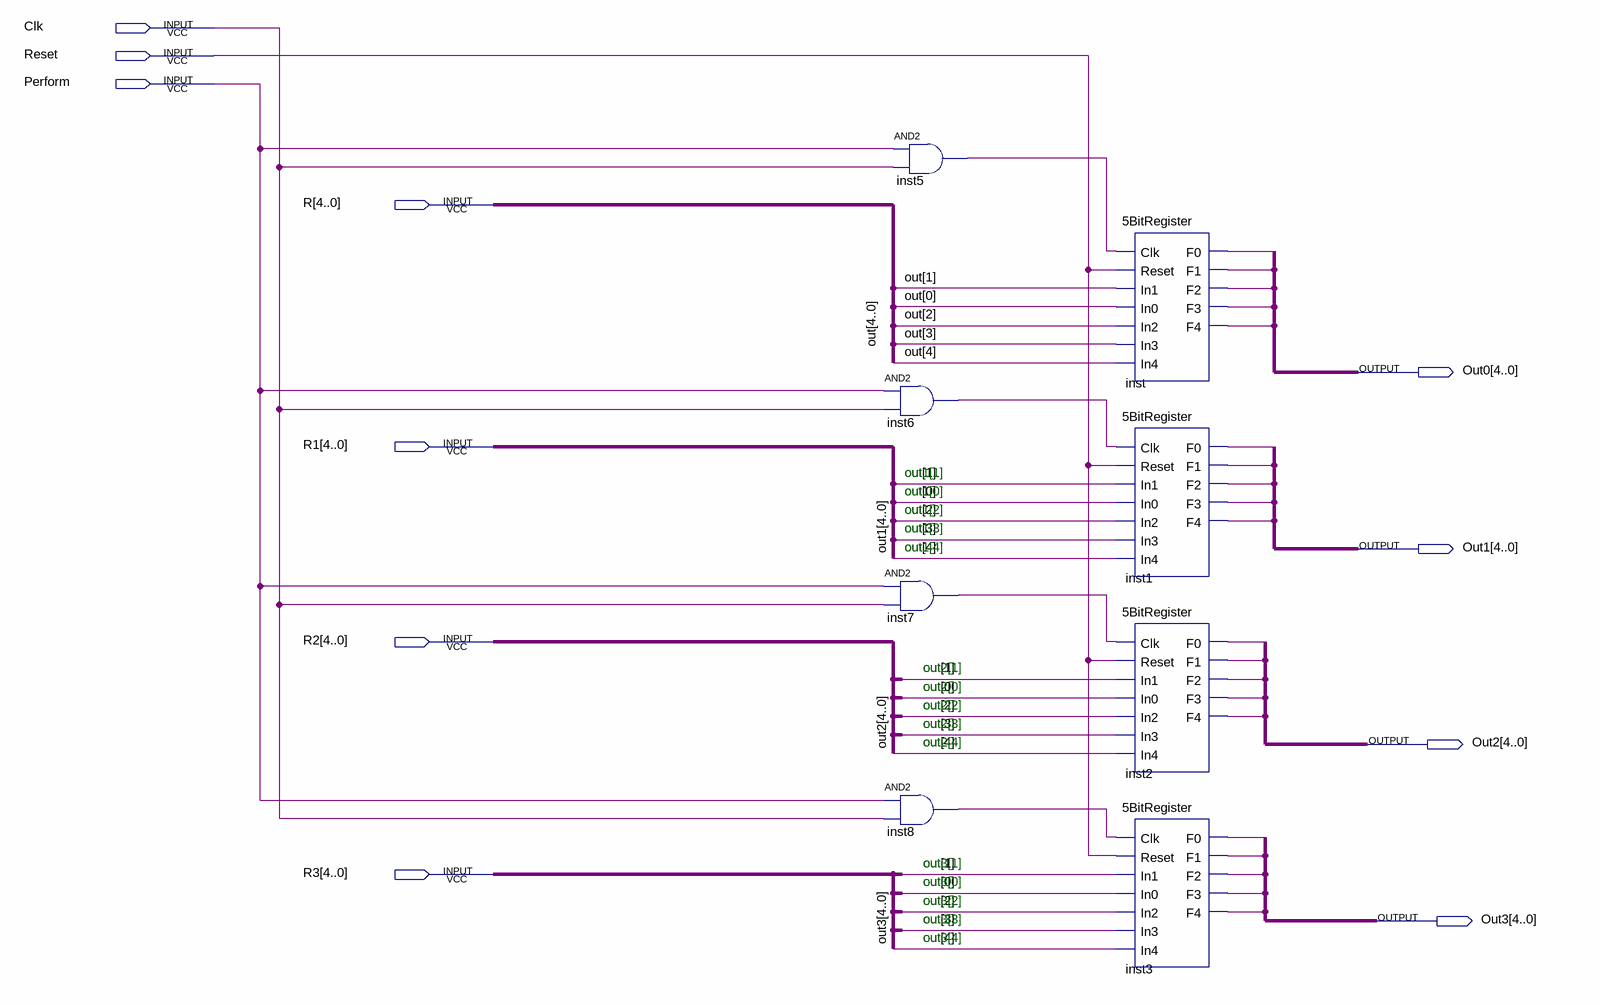
[diagram p0: schematic sheet]
// Quartus schematic FSM.bdf as structural Verilog: 8 symbols, 11 pins
module FSM (
  input  Clk,
  input  Reset,
  input  Perform,
  input  [4:0] R,
  input  [4:0] R1,
  input  [4:0] R2,
  input  [4:0] R3,
  output [4:0] Out0,
  output [4:0] Out1,
  output [4:0] Out2,
  output [4:0] Out3
);

  wire inst1_f0, inst1_f1, inst1_f2, inst1_f3, inst1_f4, inst2_f0, inst2_f1, inst2_f2, inst2_f3, inst2_f4,
       inst3_f0, inst3_f1, inst3_f2, inst3_f3, inst3_f4, inst5_out, inst6_out, inst7_out, inst8_out, inst_f0,
       inst_f1, inst_f2, inst_f3, inst_f4;

  and inst6 (inst6_out, Perform, Clk);
  and inst7 (inst7_out, Perform, Clk);
  and inst8 (inst8_out, Perform, Clk);
  and inst5 (inst5_out, Perform, Clk);
  \5BitRegister  inst (
    .Clk(inst5_out), .Reset(Reset), .In1(R[1]), .In0(R[0]), .In2(R[2]), .In3(R[3]), .In4(R[4]), .F0(inst_f0),
    .F1(inst_f1), .F2(inst_f2), .F3(inst_f3), .F4(inst_f4));
  \5BitRegister  inst1 (
    .Clk(inst6_out), .Reset(Reset), .In1(R[1]), .In0(R[0]), .In2(R[2]), .In3(R[3]), .In4(R[4]),
    .F0(inst1_f0), .F1(inst1_f1), .F2(inst1_f2), .F3(inst1_f3), .F4(inst1_f4));
  \5BitRegister  inst2 (
    .Clk(inst7_out), .Reset(Reset), .In1(R[1]), .In0(R[0]), .In2(R[2]), .In3(R[3]), .In4(R[4]),
    .F0(inst2_f0), .F1(inst2_f1), .F2(inst2_f2), .F3(inst2_f3), .F4(inst2_f4));
  \5BitRegister  inst3 (
    .Clk(inst8_out), .Reset(Reset), .In1(R[1]), .In0(R[0]), .In2(R[2]), .In3(R[3]), .In4(R[4]),
    .F0(inst3_f0), .F1(inst3_f1), .F2(inst3_f2), .F3(inst3_f3), .F4(inst3_f4));

  assign Out1 = R1;
  assign Out2 = R2;
  assign Out3 = R3;

  // Other names for the same wires on the sheet: out[4:0] = R

  // Notes on the sheet:
  //   out1[1]
  //   out1[0]
  //   out1[2]
  //   out1[3]
  //   out1[4]
  //   out2[1]
  //   out2[0]
  //   out2[2]
  //   out2[3]
  //   out2[4]
  //   out3[1]
  //   out3[0]
  //   out3[2]
  //   out3[3]
  //   out3[4]
endmodule
